# EAGLE schematic MX25R3235F (EAGLE 7.7.0)
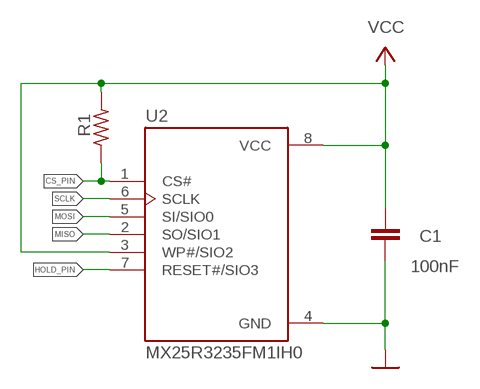
[diagram p0: schematic, sheet 1]

## Parts
C1  100nF  C-EUC0603  [C0603]
R1  R-US_R0603  [R0603]
U2  MX25R3235FM1IH0  [SOIC127P600X175-8N]

## Nets
CS_PIN: R1.1 U2.1(CS#)
GND: C1.1 U2.4(GND)
HOLD_PIN: U2.7(RESET#/SIO3)
MISO: U2.2(SO/SIO1)
MOSI: U2.5(SI/SIO0)
SCLK: U2.6(SCLK)
VCC: C1.2 R1.2 U2.3(WP#/SIO2) U2.8(VCC)

## Library data of the parts
C1 = rcl:C-EU: CAPACITOR, European symbol; SPICEPREFIX: C
R1 = rcl@1:R-US_: RESISTOR, American symbol; SPICEPREFIX: R
U2 = MX25R3235FM1IH0:MX25R3235FM1IH0: MX25R3235 Series 32 Mb (x 1/x 2/x 4) 3.6 V Surface Mount Flash Memory - SOP-8 Check prices <https://pricing.snapeda.com/parts/MX25R3235FM1IH0/Macronix/view-part?ref=eda>; AVAILABILITY: Good; DESCRIPTION: FLASH - NOR Memory IC 32Mb (4M x 8) SPI - Quad I/O 80MHz 8-SOP; MF: Macronix; MP: MX25R3235FM1IH0; PACKAGE: SOP-8 Macronix; PRICE: None; PURCHASE-URL: https://pricing.snapeda.com/search/part/MX25R3235FM1IH0/?ref=eda